# EAGLE design X-A4U-stick (EAGLE 7.2.0)
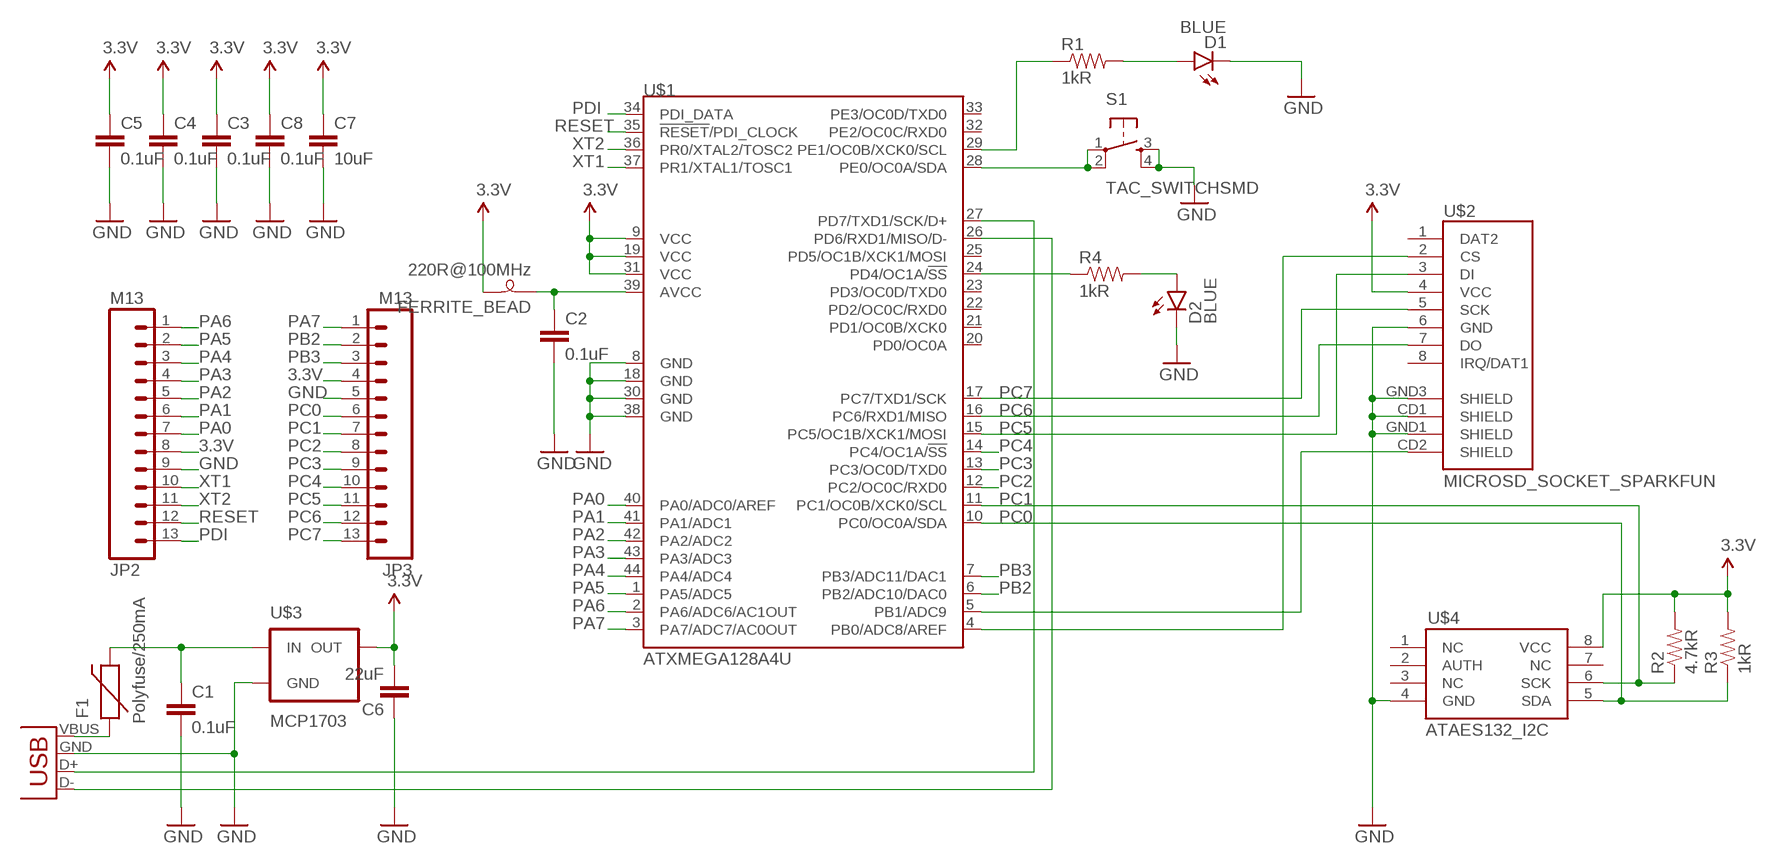
[diagram p0: schematic, sheet 1]

## Parts
C1  0.1uF  CAP0805  [0805]
C2  0.1uF  CAP0805  [0805]
C3  0.1uF  CAP0805  [0805]
C4  0.1uF  CAP0805  [0805]
C5  0.1uF  CAP0805  [0805]
C6  22uF  CAP1206  [1206]
C7  10uF  CAP1206  [1206]
C8  0.1uF  CAP1206  [1206]
D1  BLUE  LED-BLUE1206  [LED-1206]
D2  BLUE  LED-BLUE1206  [LED-1206]
F1  Polyfuse/250mA  PTCSMD-W  [PTC-1206-WIDE]
FERRITE_BEAD  220R@100MHz  FERRITE-BEAD0805  [0805]
JP1  USB-A-H  [USB-A-H]
JP2  M13  [1X13]
JP3  M13  [1X13]
R1  1kR  RESISTOR1206  [1206]
R2  4.7kR  RESISTOR1206  [1206]
R3  1kR  RESISTOR1206  [1206]
R4  1kR  RESISTOR1206  [1206]
S1  TAC_SWITCHSMD  [TACTILE-SWITCH-SMD]
U$1  ATXMEGA128A4U  [TQFP-44]
U$2  MICROSD_SOCKET_SPARKFUN  [MICROSD_SOCKET_SPARKFUN]
U$3  MCP1703  [SOT-89]
U$4  ATAES132_I2C  [SOIC-8-NARROW]

## Nets
3.3V: C3.1 C4.1 C5.1 C6.2 C7.1 C8.1 FERRITE_BEAD.2 JP2.8 JP3.4 R2.2 R3.2 U$1.9(VCC) U$1.19(VCC) U$1.31(VCC) U$2.4(VCC) U$3.3(OUT) U$4.8(VCC)
GND: C1.2 C2.2 C3.2 C4.2 C5.2 C6.1 C7.2 C8.2 D1.C D2.C JP1.GND(VBUS) JP2.9 JP3.5 S1.3 S1.4 U$1.8(GND) U$1.18(GND) U$1.30(GND) U$1.38(GND) U$2.6(GND) U$2.CD1(SHIELD) U$2.GND1(SHIELD) U$2.GND3(SHIELD) U$3.1(GND) U$4.4(GND)
N$1: JP1.D+(D-) U$1.27(PD7/TXD1/SCK/D+)
N$2: JP1.D-(D+) U$1.26(PD6/RXD1/MISO/D-)
N$3: F1.1 JP1.VBUS(GND)
N$4: D2.A R4.2
N$5: U$1.5(PB1/ADC9) U$2.CD2(SHIELD)
N$6: C2.1 FERRITE_BEAD.1 U$1.39(AVCC)
N$7: U$1.4(PB0/ADC8/AREF) U$2.2(CS)
N$8: S1.1 S1.2 U$1.28(PE0/OC0A/SDA)
N$9: R4.1 U$1.24(PD4/OC1A/!SS!)
N$11: R1.1 U$1.29(PE1/OC0B/XCK0/SCL)
N$12: D1.A R1.2
PA0: JP2.7 U$1.40(PA0/ADC0/AREF)
PA1: JP2.6 U$1.41(PA1/ADC1)
PA2: JP2.5 U$1.42(PA2/ADC2)
PA3: JP2.4 U$1.43(PA3/ADC3)
PA4: JP2.3 U$1.44(PA4/ADC4)
PA5: JP2.2 U$1.1(PA5/ADC5)
PA6: JP2.1 U$1.2(PA6/ADC6/AC1OUT)
PA7: JP3.1 U$1.3(PA7/ADC7/AC0OUT)
PB2: JP3.2 U$1.6(PB2/ADC10/DAC0)
PB3: JP3.3 U$1.7(PB3/ADC11/DAC1)
PC0: JP3.6 R3.1 U$1.10(PC0/OC0A/SDA) U$4.5(SDA)
PC1: JP3.7 R2.1 U$1.11(PC1/OC0B/XCK0/SCL) U$4.6(SCK)
PC2: JP3.8 U$1.12(PC2/OC0C/RXD0)
PC3: JP3.9 U$1.13(PC3/OC0D/TXD0)
PC4: JP3.10 U$1.14(PC4/OC1A/!SS!)
PC5: JP3.11 U$1.15(PC5/OC1B/XCK1/MOSI) U$2.3(DI)
PC6: JP3.12 U$1.16(PC6/RXD1/MISO) U$2.7(DO)
PC7: JP3.13 U$1.17(PC7/TXD1/SCK) U$2.5(SCK)
PDI: JP2.13 U$1.34(PDI_DATA)
RESET: JP2.12 U$1.35(!RESET!/PDI_CLOCK)
VBUS: C1.1 F1.2 U$3.2(IN) U$3.4(IN)
XT1: JP2.10 U$1.37(PR1/XTAL1/TOSC1)
XT2: JP2.11 U$1.36(PR0/XTAL2/TOSC2)
Unconnected: U$1.20(PD0/OC0A) U$1.21(PD1/OC0B/XCK0) U$1.22(PD2/OC0C/RXD0) U$1.23(PD3/OC0D/TXD0) U$1.25(PD5/OC1B/XCK1/MOSI) U$1.32(PE2/OC0C/RXD0) U$1.33(PE3/OC0D/TXD0) U$2.1(DAT2) U$2.8(IRQ/DAT1) U$4.1(NC) U$4.2(AUTH) U$4.3(NC) U$4.7(NC)

## Library data of the parts
C1-C8 = SparkFun-Passives:CAP: Capacitor Standard 0603 ceramic capacitor, and 0.1" leaded capacitor.
D1 D2 = SparkFun-LED:LED-BLUE: Blue LEDs for production use Various blue LEDs stocked by SparkFun production 0603 - DIO-08575 Rebel - DIO-09553 1206 - DIO-09911; PROD_ID: DIO-09911
F1 = SparkFun-PowerIC:PTC: Resettable Fuse PTC Resettable Fuse. Spark Fun Electronics SKU : COM-08357
FERRITE_BEAD = flabbergast:FERRITE-BEAD
JP1 = SparkFun-Connectors:USB: USB Connectors USB-B-PTH is fully proven SKU : PRT-00139/CONN-08278 USB-miniB is fully proven SKU : PRT-00587 USB-A-PCB is untested. USB-A-H is throughly reviewed, but untested. Spark Fun Electronics SKU : PRT-00437 USB-B-SMT is throughly reviewed, but untested. Needs silkscreen touching up. USB-A-S has not been used/tested USB-MB-H has not been used/tested USB-MICROB has been used. CONN-09505
JP2 JP3 = SparkFun-Connectors:M13: 13-pin single row .1" header
R1-R4 = SparkFun-Passives:RESISTOR: Resistor Basic schematic elements and footprints for 0603, 1206, and PTH resistors.
S1 = SparkFun-Electromechanical:TAC_SWITCH: Momentary Switch Button commonly used for reset or general input. Spark Fun Electronics SKU : COM-00097 SMT- SWCH-08247; PROD_ID: SWCH-08247
U$1 = flabbergast:ATXMEGA128A4U
U$2 = flabbergast:MICROSD_SOCKET
U$3 = flabbergast:MCP1703
U$4 = flabbergast:ATAES132_I2C: ATAES132 32Kbit AES I2C EEPROM from ATMEL

## Board
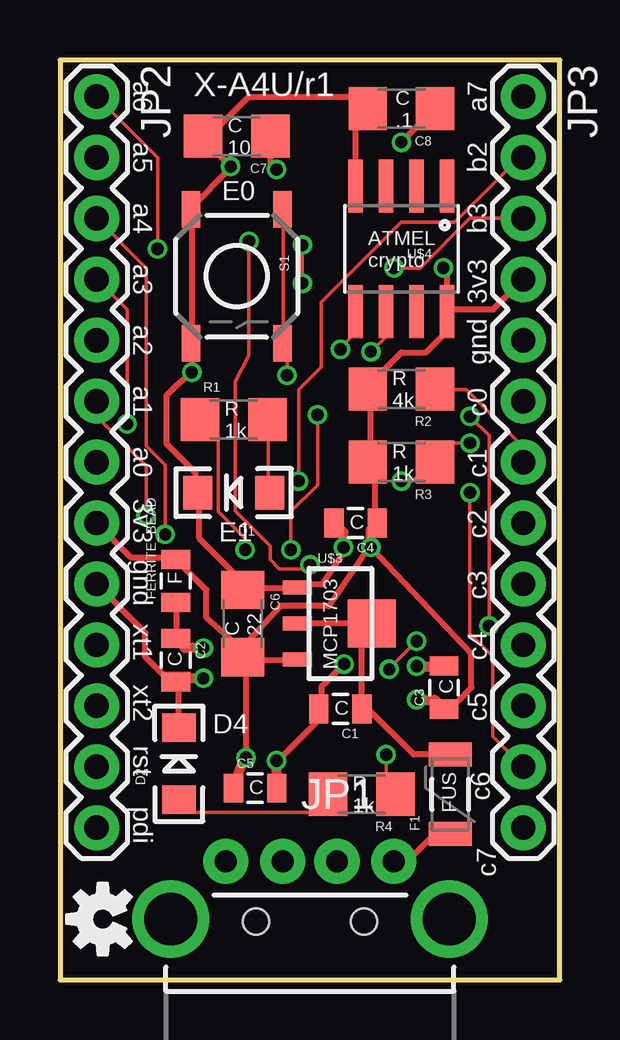
[diagram p1: board, top side]
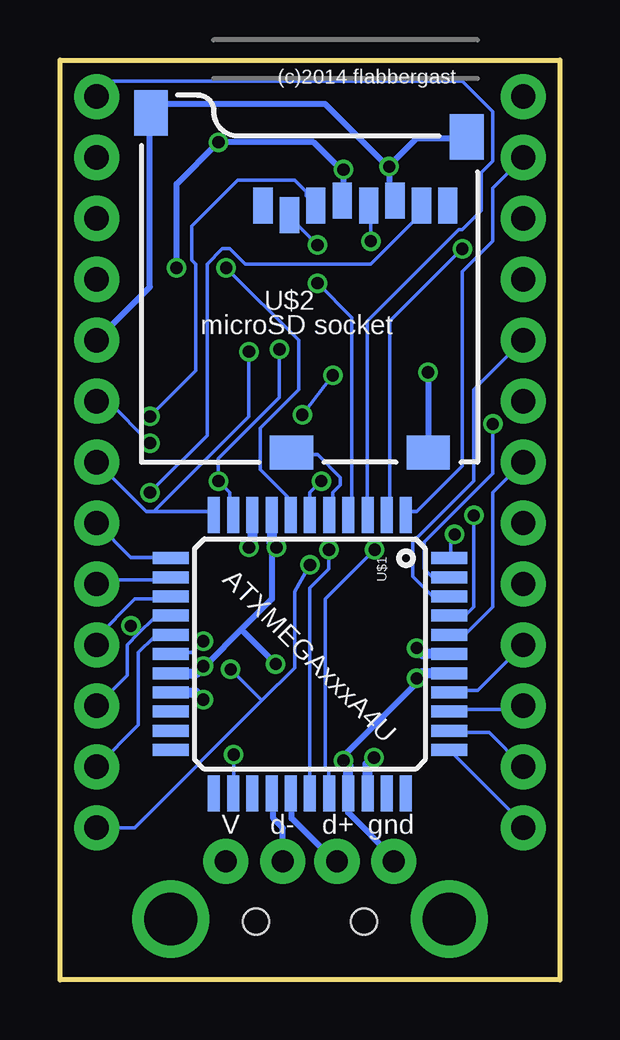
[diagram p2: board, bottom side, seen from below]

Size 20.83 x 38.35 mm. Coordinates in mm from the lower left corner, seen from the top.
Outline: 0,0 20.83,0 20.83,38.35 0,38.35 0,0
Copper layers (1*16): Top 0.035mm / dielectric 1.5mm / Bottom 0.035mm
Design rules "ITEADstudio_DRC *": minimum track width 6mil, minimum drill 20mil, track to track 7mil, track to pad 7mil, pad to pad 7mil, via to via 7mil, smd to smd 0mil, copper to edge 10mil, drill to drill 10mil, minimum pad ring 10mil, minimum via ring 6mil, stop-mask expansion 2mil, vias tented up to drill 100mil, thermal gap 10mil

### Footprints (pad centres in the part's own frame; a part is rotated, then mirrored left to right if it is on the bottom)
0805 = smd 0.8 x 1.2: 1 -0.9,0; 2 0.9,0
1206 = smd 1.6 x 1.8: 1 -1.4,0; 2 1.4,0
LED-1206 = smd 1.2 x 1.4: A -1.5,0; C 1.5,0
PTC-1206-WIDE = smd 1 x 1.8: 1 -1.654,0; 2 1.654,0
USB-A-H = drill 0.914 pad 1.88: D+ 2.4,1.127; D- 2.4,-1.127; GND 2.4,3.5; VBUS 2.4,-3.5 | drill 2.2: GND2 0,-5.8; GND3 0,5.8 | hole 1.1: -0.1,2.25; -0.1,-2.25
1X13 = drill 1.016 pad 1.88: 1 0,0; 2 2.54,0; 3 5.08,0; 4 7.62,0; 5 10.16,0; 6 12.7,0; 7 15.24,0; 8 17.78,0; 9 20.32,0; 10 22.86,0; 11 25.4,0; 12 27.94,0; 13 30.48,0
TACTILE-SWITCH-SMD = smd 1.524 x 0.762: 1 -2.794,1.905; 2 2.794,1.905; 3 -2.794,-1.905; 4 2.794,-1.905
TQFP-44 = smd 1.5 x 0.5: 1 -5.8,4; 2 -5.8,3.2; 3 -5.8,2.4; 4 -5.8,1.6; 5 -5.8,0.8; 6 -5.8,0; 7 -5.8,-0.8; 8 -5.8,-1.6; 9 -5.8,-2.4; 10 -5.8,-3.2; 11 -5.8,-4; 23 5.8,-4; 24 5.8,-3.2; 25 5.8,-2.4; 26 5.8,-1.6; 27 5.8,-0.8; 28 5.8,0; 29 5.8,0.8; 30 5.8,1.6; 31 5.8,2.4; 32 5.8,3.2; 33 5.8,4 | smd 0.5 x 1.5: 12 -4,-5.8; 13 -3.2,-5.8; 14 -2.4,-5.8; 15 -1.6,-5.8; 16 -0.8,-5.8; 17 0,-5.8; 18 0.8,-5.8; 19 1.6,-5.8; 20 2.4,-5.8; 21 3.2,-5.8; 22 4,-5.8; 34 4,5.8; 35 3.2,5.8; 36 2.4,5.8; 37 1.6,5.8; 38 0.8,5.8; 39 0,5.8; 40 -0.8,5.8; 41 -1.6,5.8; 42 -2.4,5.8; 43 -3.2,5.8; 44 -4,5.8
MICROSD_SOCKET_SPARKFUN = smd 0.8 x 1.5: 1 -8.94,10.7; 2 -7.84,10.3; 3 -6.74,10.7; 4 -5.64,10.9; 5 -4.54,10.7; 6 -3.44,10.9; 7 -2.34,10.7; 8 -1.24,10.7 | smd 1.8 x 1.4: CD1 -2.05,0.4; CD2 -7.75,0.4 | smd 1.4 x 1.9: GND1 -13.6,14.55; GND3 -0.45,13.55
SOT-89 = smd 0.58 x 1.2: 1 -1.5,-1.8; 2 0,-1.8; 3 1.5,-1.8 | smd 2 x 2: 4 0,1.3
SOIC-8-NARROW = smd 0.61 x 2.21: 1 -1.905,-2.616; 2 -0.635,-2.616; 3 0.635,-2.616; 4 1.905,-2.616; 5 1.905,2.616; 6 0.635,2.616; 7 -0.635,2.616; 8 -1.905,2.616

### Placement (x,y rotation side)
C1  11.68,11.3 180 top
C2  4.83,13.34 270 top
C3  16,12.19 90 top
C4  12.32,19.05 180 top
C5  8.13,8 0 top
C6  7.62,14.86 270 top
C7  7.37,35.18 180 top
C8  14.22,36.32 180 top
D1  7.24,20.32 180 top
D2  4.95,9.02 90 top
F1  16.26,7.75 90 top
FERRITE_BEAD  4.83,16.64 90 top
JP1  10.41,2.54 90 top
JP2  1.52,36.83 270 top
JP3  19.3,36.83 270 top
R1  7.24,23.37 0 top
R2  14.22,24.64 180 top
R3  14.22,21.59 180 top
R4  12.57,7.75 180 top
S1  7.37,29.34 270 top
U$1  10.41,13.59 270 bottom
U$2  3.43,21.59 0 bottom
U$3  11.68,14.86 270 top
U$4  14.22,30.48 180 top
U$5  [OSHW-LOGO-S]  1.78,2.54 90 top

### Tracks (layer width: path | path; a pad name or v marks a point on that pad's centre or on a via)
3.3V  (via drill 0.51)
  Top 0.152: 9.78,13.34 U$3.3 | 7.75,13.34 C6.2 | C6.2 7.87,14.13 7.21,14.13 | 13.11,21.43 12.95,21.59 R3.2 | 13.11,19.21 C4.1 | R2.2 12.95,24.61 12.95,24.89 | 15.97,11.59 C3.1 | 13.11,17.94 v12.95,18.03 12.79,17.94 | 15.49,36.2 C8.1 | 16.13,27.94 U$4.8 16.13,27.05 | 7.87,13.49 C6.2 | 16.13,29.53 v15.97,29.69 | 4.38,17.62 4.7,17.62 FERRITE_BEAD.2 4.38,17.62
  Top 0.254: C7.1 8.77,34.03 v9.02,33.78 | 9.78,13.34 7.75,13.34 v7.75,9.27 | 4.38,17.62 2.95,17.62 JP2.8 | 13.11,21.43 13.11,19.21 | 12.95,21.59 12.95,24.61 | v14.22,34.92 15.49,36.2 | JP3.4 18.03,27.94 16.13,27.94 16.13,29.53 | 7.87,14.13 9.21,15.59 11.21,15.59 12.79,17.94 | 12.95,24.89 14.22,26.16 15.24,26.16 16.13,27.05 | 7.21,14.13 6.1,15.11 6.1,16.27 FERRITE_BEAD.2 | 15.97,11.59 16.54,11.59 17.14,12.19 17.14,13.59 v12.95,18.03
  Top 0.406: v14.86,11.68 15.61,11.68 C3.1 | C5.1 7.48,8.75 v7.75,9.27 | v12.95,18.03 12.95,18.79 C4.1
  Bottom 0.152: 9.02,32.54 U$2.4 | 9.14,33.81 v9.02,33.78
  Bottom 0.254: v9.02,33.78 9.02,32.54 | 9.14,33.81 10.25,34.92 v14.22,34.92 15.97,33.18 v15.97,29.69
  Bottom 0.406: U$1.19 15.16,11.99 v14.86,11.68 | U$1.9 12.81,18.17 v12.95,18.03 | U$1.31 8.01,9 v7.75,9.27
GND  (via drill 0.51)
  Top 0.152: 6.6,35.56 6.22,35.18 C7.2 6.6,35.56 | 6.6,35.56 6.6,34.42 | 10.73,10.79 10.73,11.27 C1.2 10.89,11.43 | 9.14,9.21 v9.02,9.14 | 4.86,12.7 C2.2 | 9.78,16.35 U$3.1 9.94,16.51 | 5.81,20.32 D1.C 5.65,20.32 | 7.87,16.35 C6.1 | 11.68,17.94 v11.81,18.03 | 5.49,26.67 S1.4 5.49,26.51 | 5.49,32.07 S1.3 5.49,32.23 | 7.08,33.81 v7.11,33.91 | 12.79,36.35 C8.2 12.32,35.82 | D2.C 5.33,10.79 5.21,10.79 4.95,10.54 | 5.33,12.06 C2.2 | 4.95,12.31 C2.2
  Top 0.254: 6.6,34.42 v7.11,33.91 | 9.14,9.21 10.73,10.79 | 9.78,16.35 7.87,16.35 5.81,18.41 5.81,20.32 | 11.68,17.94 11.68,17.62 10.95,16.51 9.94,16.51 | 5.49,32.07 5.49,26.67 | 5.49,26.51 v5.49,25.34 4.83,24.77 4.45,24.38 4.45,22.35 5.65,21.14 5.65,20.32 | 5.49,32.23 7.08,33.81 | 10.89,11.43 10.89,12.22 v11.84,13.18 | U$4.4 12.32,35.82 | 5.33,12.7 4.86,12.7 4.32,12.7 3.56,13.46 3.56,14.48 JP2.9 | 6.6,35.56 7.87,36.83 12.95,36.83 12.82,36.7 C8.2 | 4.95,10.54 4.95,12.31
  Top 0.406: v14.86,13.08 15.99,13.08 C3.2 | v9.02,9.14 9.02,8.27 C5.2 | v5.97,12.57 4.96,12.57 C2.2 | v11.81,18.03 11.81,18.66 C4.2
  Bottom 0.152: 7.11,32.73 U$2.6 | 5.97,12.38 v5.97,12.57 | 9.14,9.21 v9.02,9.14 | 8.83,6.99 8.83,7.62 U$1.30 | 6.92,5.08 JP1.GND | 17.08,36.04 U$2.GND1 16.92,36.2 | 14.7,13.18 v14.86,13.08 | 12,17.94 v11.81,18.03 | 3.9,35.08 U$2.GND3 | 7.08,33.97 v7.11,33.91 7.24,33.97 | 5.49,22.07 U$2.CD1
  Bottom 0.254: v7.11,33.91 7.11,32.73 | 9.14,9.21 5.97,12.38 | 6.92,5.08 8.83,6.99 | 17.08,36.04 17.08,28.89 JP3.5 | 13.27,14.61 12,15.88 12,17.94 | 13.27,14.61 14.7,13.18 | 3.9,35.08 5.97,35.08 7.08,33.97 | v5.49,25.34 5.49,22.07 | 7.24,33.97 9.78,36.51 16.57,36.51 U$2.GND1 | 13.27,14.61 v11.84,13.18
  Bottom 0.406: U$1.18 15.15,12.79 v14.86,13.08 | U$1.30 8.81,8.94 v9.02,9.14 | U$1.38 5.75,12.79 v5.97,12.57 | U$1.8 12.01,18.24 v11.81,18.03
N$1
  Bottom 0.254: JP1.D+ 9.38,4.94 11.18,6.73 11.18,7.75 U$1.27
N$2
  Bottom 0.254: JP1.D- 11.54,6.33 11.94,6.73 11.94,7.71 U$1.26
N$3
  Top 0.254: JP1.VBUS 14.46,4.94 15.62,6.1
  Top 0.406: 15.62,6.1 F1.1
N$4
  Top 0.152: D2.A 5.33,6.99 10.41,6.99 11.05,7.62 R4.2
N$5
  Bottom 0.152: U$1.5 9.46,19.53 9.46,20.32 9.14,20.64 9.14,20.95 10.1,21.91 11.05,21.91 U$2.CD2
N$6  (via drill 0.51)
  Top 0.152: 4.86,15.72 FERRITE_BEAD.1 | 4.86,14.29 C2.1
  Top 0.254: 4.86,14.29 4.86,15.72
  Top 0.406: v5.97,13.84 5.22,13.84 C2.1
  Bottom 0.406: U$1.39 5.71,13.59 v5.97,13.84
N$7  (via drill 0.51)
  Top 0.152: v10.1,30.64 v10.1,29.05
  Bottom 0.152: v10.1,29.05 8.67,27.62 8.67,19.53 U$1.4 | v10.1,30.64 11.21,31.75 U$2.2
N$8  (via drill 0.51)
  Top 0.152: v9.62,17.94 9.62,19.53 10.73,20.64 v10.73,23.56 | v9.46,25.21 9.46,26.35 S1.2 9.3,26.67 9.3,32.07 S1.1
  Bottom 0.152: U$1.28 10.41,16.35 9.62,17.14 v9.62,17.94 | v9.46,25.21 v10.73,23.56
N$9  (via drill 0.51)
  Top 0.152: v13.59,9.4 13.59,7.62 R4.1
  Bottom 0.152: v13.59,9.4 13.59,8.26 U$1.24
N$11  (via drill 0.51)
  Top 0.152: v7.71,17.94 7.71,18.41 6.6,19.53 6.6,22.7 5.97,23.34 R1.1
  Bottom 0.152: v7.71,17.94 9.78,15.88 9.78,8.89 9.62,8.73 9.62,7.94 U$1.29
N$12
  Top 0.152: D1.A 8.67,20.32 8.67,23.34 R1.2
PA0
  Bottom 0.152: JP2.7 2.79,20.32 2.79,15.56 3.9,14.45 4.54,14.45 U$1.40
PA1  (via drill 0.51)
  Top 0.152: v3.59,19.37 3.59,21.43 1.52,23.5 JP2.6
  Bottom 0.152: v3.59,19.37 3.59,15.56 3.9,15.24 4.54,15.24 U$1.41
PA2
  Bottom 0.152: JP2.5 3.59,24.61 3.59,20.8 6.13,18.26 6.13,16.83 5.33,16.03 4.7,16.03 U$1.42
PA3  (via drill 0.51)
  Top 0.152: v2.79,23.18 2.79,27.94 JP2.4
  Bottom 0.152: v2.79,23.18 2.79,21.11 5.65,18.26 5.65,17.14 5.33,16.83 4.7,16.83 U$1.43
PA4  (via drill 0.51)
  Top 0.152: v4.38,18.57 4.38,21.46 3.59,22.26 3.59,29.69 JP2.3
  Bottom 0.152: v4.38,18.57 4.54,18.41 4.54,17.62 U$1.44
PA5
  Bottom 0.152: JP2.2 2.79,33.02 2.79,30.8 4.06,29.53 4.06,21.43 5.97,19.53 6.29,19.53 U$1.1
PA6  (via drill 0.51)
  Top 0.152: v4.06,30.48 4.06,34.29 JP2.1
  Bottom 0.152: v4.06,30.48 7.08,27.46 7.08,19.53 U$1.2
PA7
  Bottom 0.152: JP3.1 18.67,37.47 4.06,37.47 2.79,36.2 2.79,34.13 3.27,33.66 3.27,32.07 4.06,31.27 4.22,31.27 8.03,27.46 8.03,19.53 U$1.3
PB2  (via drill 0.51)
  Top 0.152: v9.94,20.8 9.94,24.61 10.89,25.56 10.89,28.26 14.22,31.59 16.45,31.59 19.14,34.29 JP3.2
  Bottom 0.152: U$1.6 10.41,20.32 v9.94,20.8
PB3  (via drill 0.51)
  Top 0.152: v13.91,29.69 15.02,29.69 17.08,31.75 JP3.3
  Bottom 0.152: v13.91,29.69 10.89,26.67 10.89,24.61 12.48,23.02 12.48,21.27 11.37,20.16 11.37,19.53 U$1.7
PC0  (via drill 0.51)
  Top 0.152: v14.22,20.8 14.7,20.8 15.49,21.59 R3.1 15.65,21.59 16.45,22.38 v17.08,22.38 | U$4.5 12.32,27.05 v11.68,26.29
  Bottom 0.152: U$1.10 13.75,19.53 13.75,20.32 v14.22,20.8 14.22,21.75 11.68,24.29 v11.68,26.29 | JP3.6 18.83,24.13 v17.08,22.38
PC1  (via drill 0.51)
  Top 0.152: JP3.7 19.3,22.23 16.92,24.61 15.65,24.61 R2.1 | U$4.6 13.59,26.83 v12.95,26.19
  Bottom 0.152: 16.92,19.53 17.24,19.53 JP3.7 | 16.92,19.53 14.54,19.53 U$1.11 | v12.95,26.19 12.95,23.5 16.92,19.53
PC2
  Bottom 0.152: JP3.8 17.88,17.62 16.29,17.62 U$1.12
PC3
  Bottom 0.152: JP3.9 19.14,16.67 16.29,16.67 U$1.13
PC4
  Bottom 0.152: JP3.10 19.3,14.29 17.72,15.88 16.29,15.88 U$1.14
PC5  (via drill 0.51)
  Top 0.152: v17.08,23.5 17.88,22.7 v17.88,14.76
  Bottom 0.152: 17.56,14.45 18.03,13.97 18.03,12.7 JP3.11 | 17.56,14.45 16.92,15.08 16.29,15.08 U$1.15 | v17.08,23.5 15.18,25.4 15.18,29.84 15.33,30 15.33,31.43 13.43,33.34 11.05,33.34 10.57,32.86 10.57,32.7 10.25,32.38 U$2.3 | 17.56,14.45 v17.88,14.76
PC6  (via drill 0.51)
  Top 0.152: v17.08,20.32 17.08,14.45 18.03,13.49 18.03,10.16 JP3.12
  Bottom 0.152: JP3.12 17.56,10.64 17.56,13.65 16.92,14.29 16.29,14.29 U$1.16 | v17.08,20.32 14.7,22.7 14.7,29.84 14.06,30.48 13.75,30.48 13.11,29.84 7.87,29.84 5.81,31.91 5.81,32.23 U$2.7
PC7  (via drill 0.51)
  Top 0.152: v14.86,14.13 14.06,13.34 v13.72,12.95 | v7.87,30.8 7.87,26.04 7.3,24.96 7.3,19.56 8.76,18.1 8.76,17.53 9.14,17.14 10.25,17.14 v10.41,17.3
  Bottom 0.152: v14.86,14.13 15.33,13.65 16.13,13.65 U$1.17 | v7.87,30.8 7.87,32.23 U$2.5 | v10.41,17.3 11.05,16.19 11.05,13.02 12.41,11.65 | 12.41,11.65 17.72,6.35 JP3.13 | v13.72,12.95 12.41,11.65
PDI
  Bottom 0.152: JP2.13 1.52,6.51 4.54,9.53 U$1.34
RESET
  Bottom 0.152: JP2.12 2.95,10.32 4.54,10.32 U$1.35
VBUS
  Top 0.254: F1.2 14.73,9.4 12.83,11.3 | U$3.2 U$3.4 12.83,14.86 12.57,14.61 12.57,11.56 12.83,11.3 | 12.83,11.3 C1.1
  Top 0.406: 13.08,14.76 U$3.4
XT1
  Bottom 0.152: JP2.10 3.43,12.06 4.54,12.06 U$1.37
XT2
  Bottom 0.152: JP2.11 1.68,11.27 4.54,11.27 U$1.36

### Text on the board
tPlace: X-A4U/r1 | a6 | C / .1 | a7 | a5 | C / 10 | b2 | E0 | a4 | b3 | a3 | ATMEL / crypto | 3v3 | a2 | gnd | a1 | R / 4k | R / 1k | c0 | a0 | R / 1k | c1 | 3v3 | C | gnd | E1 | c2 | F | c3 | xt1 | C / 22 | C | MCP1703 | c4 | xt2 | C | C | c5 | rst | D4 | C | pdi | R / 1k | FUS | c6 | c7
bPlace: (c)2014 flabbergast | microSD socket | ATXMEGAxxxA4U | gnd | d+ | d- | V